# Altium schematic sheet Connectors.SchDoc: Connectors
size Letter; DrawnBy: Ayesha Ebrahim; Organization: UW Robotics; Address1: 200 University Avenue; Address2: Waterloo; Address3: Ontario; Address4: Canada N2L 3G6; SheetNumber: 2; SheetTotal: 6
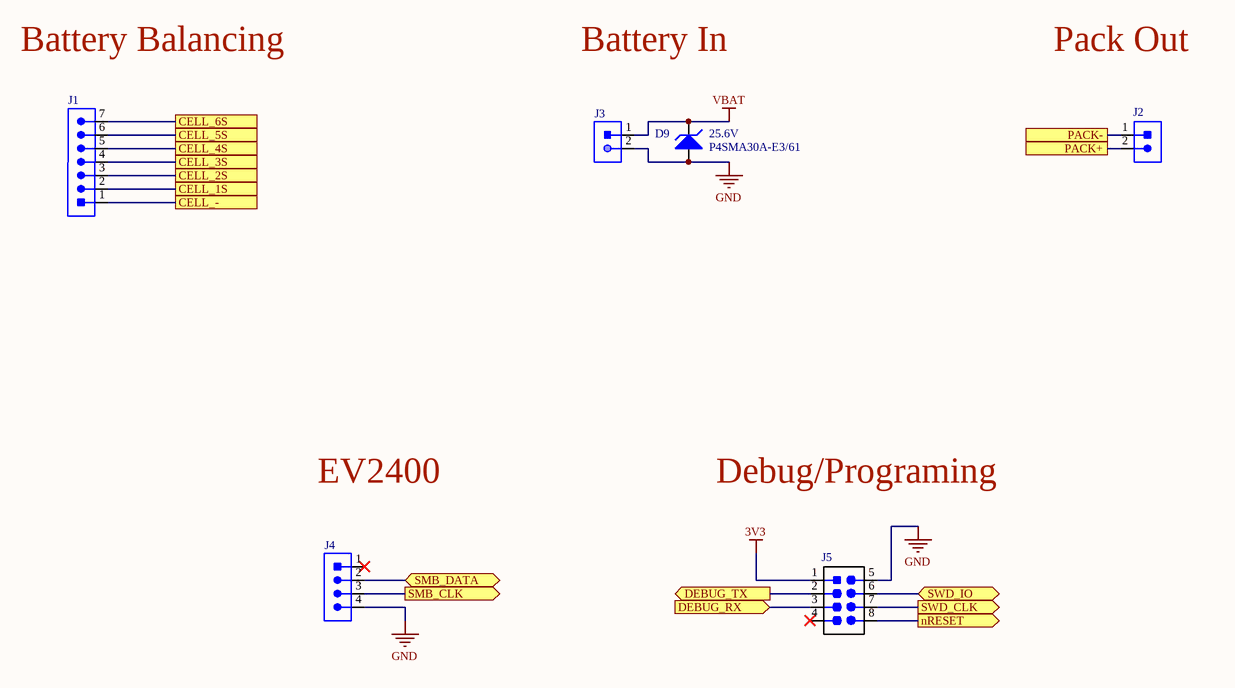
[diagram p0: Connectors.SchDoc]

## Parts
D9  Reverse Standoff Voltage: 25.6V  [DO-214AC_UNI]  (hidden comment: P4SMA30A-E3/61)
J1  CON_7M_TH_RA  [JST_S7B-XH-A(LF)(SN)]  (value not drawn)
J2  SCREW_TERM_115A  [MOLEX-0399200302]  (value not drawn)
J3  XT90  [XT90]  (value not drawn)
J4  CON_4M_TH_RA  [MOLEX-22-05-3041_V]  (value not drawn)
J5  HEADER 4X2  [HEADER_2X4]  (value not drawn)

## Ports
CELL_1S, CELL_2S, CELL_3S, CELL_4S, CELL_5S, CELL_6S, CELL_-, DEBUG_RX (in), DEBUG_TX (out), nRESET (out), PACK+, PACK-, SMB_CLK (out), SMB_DATA (bidir), SWD_CLK (out), SWD_IO (bidir)

## Nets
3V3: J5.1(VCC)
GND: D9.1 J3.2 J4.4 J5.5(GND)
VBAT: D9.2 J3.1
CELL_1S: J1.2 ; port CELL_1S
CELL_2S: J1.3 ; port CELL_2S
CELL_3S: J1.4 ; port CELL_3S
CELL_4S: J1.5 ; port CELL_4S
CELL_5S: J1.6 ; port CELL_5S
CELL_6S: J1.7 ; port CELL_6S
CELL_-: J1.1 ; port CELL_-
DEBUG_RX: J5.3 ; port DEBUG_RX
DEBUG_TX: J5.2 ; port DEBUG_TX
nRESET: J5.8 ; port nRESET
PACK+: J2.2 ; port PACK+
PACK-: J2.1 ; port PACK-
SMB_CLK: J4.3 ; port SMB_CLK
SMB_DATA: J4.2 ; port SMB_DATA
SWD_CLK: J5.7 ; port SWD_CLK
SWD_IO: J5.6 ; port SWD_IO

Not connected (* = marked no-connect by the designer): J4 1*; J5 4*

## Notes on the sheet
- Battery Balancing
- Battery In
- Pack Out
- EV2400
- Debug/Programing
- Title
- Size:
- Date:
- Letter
- Drawn By:
- Sheet
- of
- File:

## Library data of the parts
D9 = P4SMA30A-E3/61: TVS DIODE, 400W, 25.6V, UNI, DO-214AC; Manufacturer 1: Vishay Semiconductors; Element Configuration: Single; Leakage Current: 1uA; Direction: Unidirectional; Reverse Breakdown Voltage: 28.5V; Max Surge Current: 40A; Number of Unidirectional Channels: 1; Clamping Voltage: 41.4V; Power Line Protection: No; Test Current: 1mA; Peak Pulse Current: 9.7A; Supplier 1: Digi-Key; RoHS: Yes; Category: TVS Diodes; Stock 1: 1849; Pricing 1: 1=0.35000, 10=0.28400, 25=0.26000, 100=0.16340, 250=0.16152, 500=0.15126 (USD); Mount: Surface Mount; Case/Package: SMA; Number of Pins: 2; Min Operating Temperature: -65°C; Max Operating Temperature: 150°C; Max Power Dissipation: 400W; Composition: Zener; Packaging: Tape and Reel; Package Quantity: 1800; Operating Supply Voltage: 25.6V; Polarity: Unidirectional; Min Breakdown Voltage: 28.5V; Peak Pulse Power: 400W; Breakdown Voltage: 28.5V; Number of Channels: 1; Max Reverse Leakage Current: 1uA; Number of Elements: 1; ComponentLink1URL: https://datasheet.ciiva.com:443/pdfs/VipMasterIC/IC/VISH/VISH-S-A0008073361/VISH-S-A0008073361-1.pdf?src-supplier=IHS+Markit; ComponentLink1Description: https://datasheet.ciiva.com:443/pdfs/VipMasterIC/IC/VISH/VISH-S-A0008073361/VISH-S-A0008073361-1.pdf?src-supplier=IHS+Markit; ComponentLink2URL: https://datasheet.ciiva.com/343/p4sma-343073.pdf?src-supplier=Digi-Key; ComponentLink2Description: https://datasheet.ciiva.com/343/p4sma-343073.pdf?src-supplier=Digi-Key; Supplier Part Number 1: P4SMA30A-E3/61GICT-ND; Manufacturer Part Number 1: P4SMA30A-E3/61
J1 = CON_7M_TH_RA: CONN HEADER XH SIDE 7POS 2.5MM; Manufacturer 1: JST Sales America Inc.; Manufacturer Part Number 1: S7B-XH-A(LF)(SN); Current Rating: 3A; Voltage Rating: 250V; Contact Resistance: 10mR; Gender: Male; Number of Positions: 7; Insulation Resistance: 1GR; Connector Type: Header,Male Pin; Wire/Cable Gauge: 22AWG; Supplier 1: Digi-Key; RoHS: Yes; Category: Headers and Wire Housings; Pricing 2: 10=1.05000, 100=0.92700, 500=0.83300, 1000=0.81300, 5000=0.74700, 10000=0.69900 (CAD); Mount: Through Hole; Contact Material: Brass; Contact Plating: Tin,Lead; Color: Natural; Contact Shape: Square; Insulation Material: Nylon; Insulation Color: Natural; Min Operating Temperature: -25°C; Max Operating Temperature: 85°C; Number of Rows: 1; Voltage Rating (AC): 250V; Package Quantity: 250; Packaging: Bulk; Orientation: Right Angle; Fastening Type: Detent; Termination: Solder; Number of Contacts: 7; Pitch: 2.5mm; Lead Pitch: 2.5mm; REACH SVHC: No SVHC; Flammability Rating: UL94 V-0; Lead Free: Lead Free; ComponentLink1URL: https://datasheet.ciiva.com/726/exh-726397.pdf?src-supplier=Digi-Key; ComponentLink1Description: https://datasheet.ciiva.com/726/exh-726397.pdf?src-supplier=Digi-Key; ComponentLink2URL: https://datasheet.ciiva.com/8052/5448-8052233.pdf?src-supplier=Element14; ComponentLink2Description: https://datasheet.ciiva.com/8052/5448-8052233.pdf?src-supplier=Element14; ComponentLink3URL: https://datasheet.ciiva.com/16484/exh-16484539.pdf?src-supplier=Future+Electronics; ComponentLink3Description: https://datasheet.ciiva.com/16484/exh-16484539.pdf?src-supplier=Future+Electronics; Supplier Part Number 1: 455-2240-ND
J2 = SCREW_TERM_115A: CONN TERM BLOCK 2POS 15MM 1-8AWG; Manufacturer 1: Molex; Manufacturer Part Number 1: 0399200302; Plating: Brass,Bronze,Tin; Number of Levels: 1; Number of Positions Per Level: 2; Current: 115A; Voltage: 600V; Pitch: 0.591inch; Wire Gauge (Max): 8AWG; Wire Gauge (Min): 1AWG; Supplier 1: Digi-Key; Supplier Part Number 1: WM20114-ND; RoHS: Yes; Category: Terminal Blocks; Stock 2: 268; Pricing 2: 1=9.66000, 10=8.27400, 25=7.89600, 50=7.09800, 100=6.72000, 250=6.09000, 500=5.67000, 1000=5.35500, 5000=5.04000 (USD); Mount: Through Hole; Housing Material: Polybutylene; Contact Material: Copper; Color: Black; Contact Plating: Copper,Tin,Bright; Housing Color: Black; Min Operating Temperature: -40°C; Max Operating Temperature: 130°C; Termination: Solder; Packaging: Bulk; Number of Rows: 1; Orientation: Straight; Number of Circuits: 2; Number of Contacts: 2; Max Supply Voltage (AC): 600V; Max Voltage Rating (AC): 600V; Length: 32mm; Depth: 20.32mm; Radiation Hardening: No; ComponentLink1URL: https://datasheet.ciiva.com/6751/399200305-sd-6751818.pdf?src-supplier=Digi-Key; ComponentLink1Description: https://datasheet.ciiva.com/6751/399200305-sd-6751818.pdf?src-supplier=Digi-Key
J3 = XT90: HIGH QUALITY GOLD PLATED XT90 MA; Manufacturer 1: DFRobot; Manufacturer Part Number 1: FIT0588; Supplier 1: Digi-Key; Supplier Part Number 1: 1738-1438-ND
J4 = CON_4M_TH_RA: CONN HEADER R/A 4POS 2.54MM; Manufacturer 1: Molex; Number of Contacts: 4; Contact Resistance: 10mR; Gender: Male; Max Current Rating: 4A; Voltage Rating: 250V; Insulation Resistance: 50GR; Approvals: UL,CSA; Glow Wire Compliant: Non-compliant; Supplier 1: Digi-Key; Supplier Part Number 1: WM4302-ND; Manufacturer Part Number 1: 22-05-3041; RoHS: Yes; Category: Headers and Wire Housings; Stock 2: 1752; Pricing 2: 1=0.51000, 10=0.47800, 100=0.36620, 500=0.31840, 1000=0.26268, 5000=0.23084, 10000=0.21492 (USD); Mount: Through Hole; Contact Plating: Tin,Copper; Contact Material: Brass; Color: White; Housing Color: White; Housing Material: Nylon; Min Operating Temperature: 0°C; Max Operating Temperature: 75°C; Number of Rows: 1; Termination: Through Hole; Orientation: Right Angle; Packaging: Bulk; Current Rating: 4A; Package Quantity: 12000; Contact Gender: Male; Number of Positions: 4; Voltage Rating (DC): 250V; Number of Circuits: 4; Length: 10.16mm; Height: 6.35mm; Pitch: 2.54mm; Depth: 12.83mm; Radiation Hardening: No; REACH SVHC: Unknown; Halogen Free: Low Halogen; Lead Free: Lead Free; Flammability Rating: UL94 V-0; ComponentLink1URL: https://datasheet.ciiva.com/7106/1710343-7106224.pdf?src-supplier=Newark; ComponentLink1Description: https://datasheet.ciiva.com/7106/1710343-7106224.pdf?src-supplier=Newark; ComponentLink2URL: https://datasheet.ciiva.com/19462/233453-19462483.pdf?src-supplier=Jameco; ComponentLink2Description: https://datasheet.ciiva.com/19462/233453-19462483.pdf?src-supplier=Jameco; ComponentLink3URL: https://datasheet.ciiva.com/10090/0022053041-pcb-headers-10090549.pdf?src-supplier=Avnet; ComponentLink3Description: https://datasheet.ciiva.com/10090/0022053041-pcb-headers-10090549.pdf?src-supplier=Avnet; ComponentLink4URL: https://datasheet.ciiva.com/5153/0022053041-pcb-headers-158631-5153963.pdf?src-supplier=Mouser; ComponentLink4Description: https://datasheet.ciiva.com/5153/0022053041-pcb-headers-158631-5153963.pdf?src-supplier=Mouser; ComponentLink5URL: https://datasheet.ciiva.com/11746/0900766b80d8f337-11746364.pdf?src-supplier=RSComponents; ComponentLink5Description: https://datasheet.ciiva.com/11746/0900766b80d8f337-11746364.pdf?src-supplier=RSComponents; ComponentLink6URL: https://datasheet.ciiva.com/3933/302090022053041-pcb-headers-3933101.pdf?src-supplier=Arrow; ComponentLink6Description: https://datasheet.ciiva.com/3933/302090022053041-pcb-headers-3933101.pdf?src-supplier=Arrow; ComponentLink7URL: https://datasheet.ciiva.com/19462/1965841-19462350.pdf?src-supplier=Jameco; ComponentLink7Description: https://datasheet.ciiva.com/19462/1965841-19462350.pdf?src-supplier=Jameco; ComponentLink8URL: https://datasheet.ciiva.com/7843/1631486-7843895.pdf?src-supplier=Element14; ComponentLink8Description: https://datasheet.ciiva.com/7843/1631486-7843895.pdf?src-supplier=Element14; ComponentLink9URL: https://datasheet.ciiva.com/16656/0022053041-pcb-headers-16656124.pdf?src-supplier=Avnet+Europe; ComponentLink9Description: https://datasheet.ciiva.com/16656/0022053041-pcb-headers-16656124.pdf?src-supplier=Avnet+Europe
J5 = HEADER 4X2: CONN HEADER VERT 8POS 2.54MM; Manufacturer Part Number 1: M20-9980445; Manufacturer 1: Harwin Inc.; Supplier Part Number 1: 952-2122-ND; Supplier 1: Digi-Key; Mount: Through Hole